# EAGLE design bird (EAGLE 8.3.2)
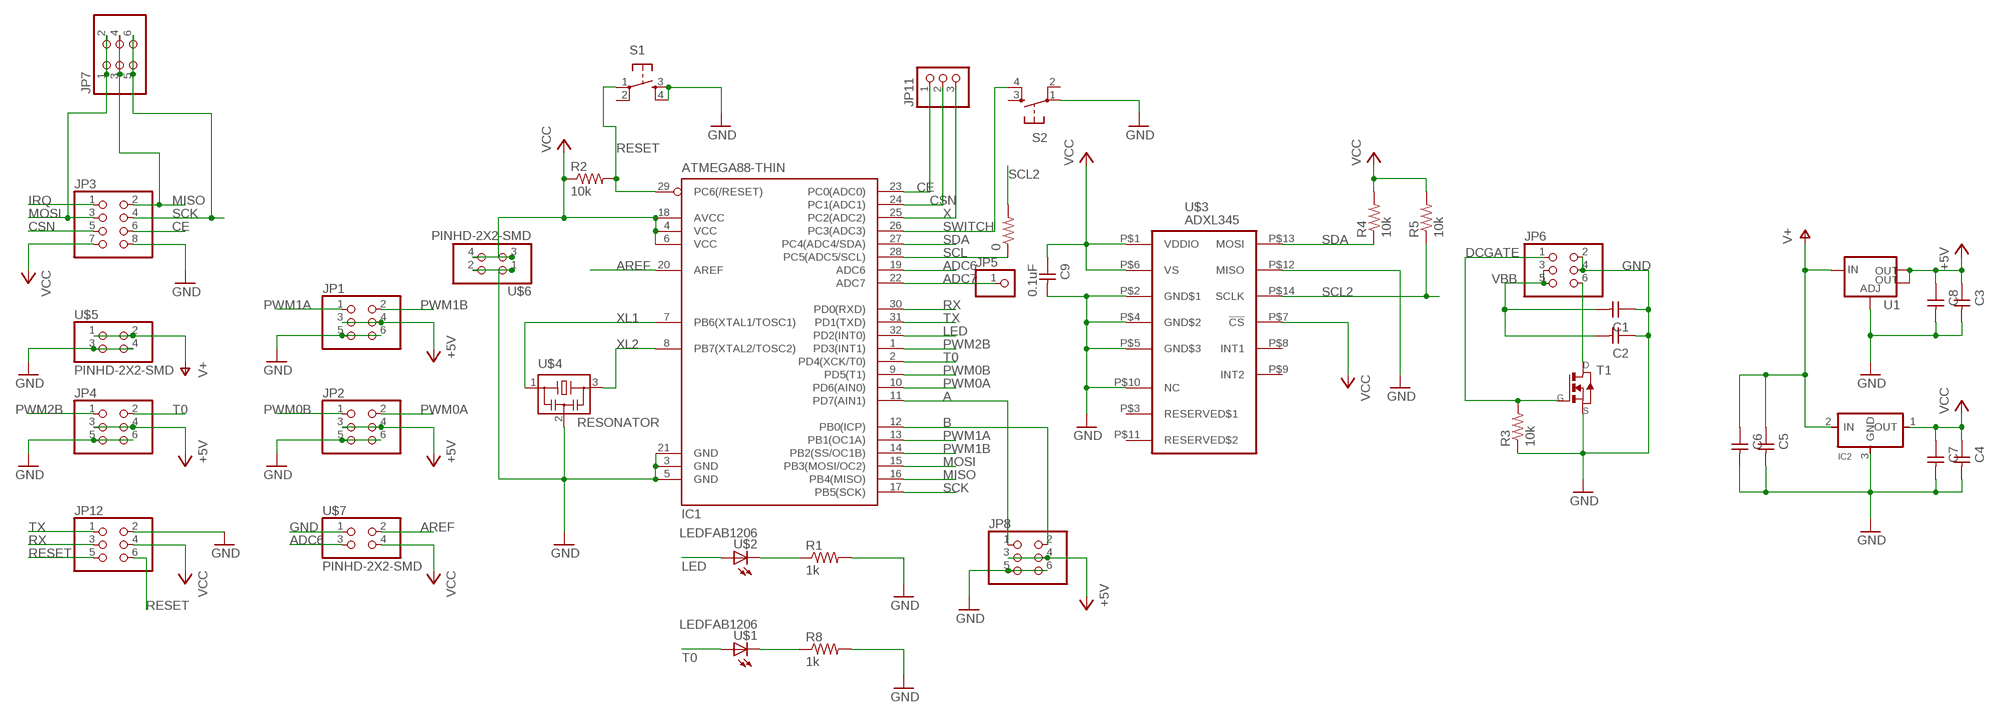
[diagram p0: schematic, sheet 1]

## Parts
0  RES-US1206FAB  [R1206FAB]
C1  CAP-UNPOLARIZEDFAB  [C1206FAB]
C2  CAP-UNPOLARIZEDFAB  [C1206FAB]
C3  CAP-UNPOLARIZEDFAB  [C1206FAB]
C4  CAP-UNPOLARIZEDFAB  [C1206FAB]
C5  CAP-UNPOLARIZEDFAB  [C1206FAB]
C6  CAP-UNPOLARIZEDFAB  [C1206FAB]
C7  CAP-UNPOLARIZEDFAB  [C1206FAB]
C8  CAP-UNPOLARIZEDFAB  [C1206FAB]
C9  0.1uF  CAP-UNPOLARIZEDFAB  [C1206FAB]
IC1  ATMEGA88-THIN  [TQFP32-08THIN]
IC2  REGULATORSOT23  [SOT23]
JP1  PINHD-2X3-SMD  [2X03SMD]
JP2  PINHD-2X3-SMD  [2X03SMD]
JP3  PINHD-2X4SMT  [2X04_SMT]
JP4  PINHD-2X3-SMD  [2X03SMD]
JP5  PINHD-1X1  [1X01]
JP6  PINHD-2X3-SMD  [2X03SMD]
JP7  PINHD-2X3-SMD  [2X03SMD]
JP8  PINHD-2X3-SMD  [2X03SMD]
JP11  PINHD-1X3  [1X03]
JP12  PINHD-2X3-SMD  [2X03SMD]
R1  1k  RES-US1206FAB  [R1206FAB]
R2  10k  RES-US1206FAB  [R1206FAB]
R3  10k  RES-US1206FAB  [R1206FAB]
R4  10k  RES-US1206FAB  [R1206FAB]
R5  10k  RES-US1206FAB  [R1206FAB]
R8  1k  RES-US1206FAB  [R1206FAB]
S1  6MM_SWITCH6MM_SWITCH  [6MM_SWITCH]
S2  6MM_SWITCH6MM_SWITCH  [6MM_SWITCH]
T1  NMOSFETSOT23  [SOT-23]
U1  V_REG_LM1117SOT223  [SOT223]
U$1  LEDFAB1206  [LED1206FAB]
U$2  LEDFAB1206  [LED1206FAB]
U$3  ADXL345  [LGA14]
U$4  RESONATOR  [EFOBM]
U$5  PINHD-2X2-SMD  [2X02SMD]
U$6  PINHD-2X2-SMD  [2X02SMD]
U$7  PINHD-2X2-SMD  [2X02SMD]

## Nets
+5V: C3.1 C8.1 JP1.3 JP1.4 JP2.3 JP2.4 JP4.3 JP4.4 JP8.3 JP8.4 U1.2(OUT) U1.4(OUT)
A: IC1.11(PD7(AIN1)) JP8.1
ADC6: IC1.19(ADC6) U$7.3
ADC7: IC1.22(ADC7) JP5.1
AREF: IC1.20(AREF) U$7.2
B: IC1.12(PB0(ICP)) JP8.2
CE: IC1.23(PC0(ADC0)) JP3.6 JP11.1
CSN: IC1.24(PC1(ADC1)) JP3.5 JP11.2
DCGATE: JP6.1 R3.2 T1.3(G)
GND: C1.1 C2.1 C3.2 C4.2 C5.2 C6.2 C7.2 C8.2 C9.2 IC1.3(GND) IC1.5(GND) IC1.21(GND) IC2.3(GND) JP1.5 JP1.6 JP2.5 JP2.6 JP3.8 JP4.5 JP4.6 JP6.2 JP6.4 JP8.5 JP8.6 JP12.2 R1.2 R3.1 R8.2 S1.3(S) S1.4(S1) S2.1(P) T1.2(S) U1.1(ADJ) U$3.P$2(GND$1) U$3.P$4(GND$2) U$3.P$5(GND$3) U$3.P$10(NC) U$3.P$12(MISO) U$4.2 U$5.3 U$5.4 U$6.1 U$6.2 U$7.1
IRQ: JP3.1
LED: IC1.32(PD2(INT0)) U$2.1(A)
MISO: IC1.16(PB4(MISO)) JP3.2 JP7.3 JP7.4
MOSI: IC1.15(PB3(MOSI/OC2)) JP3.3 JP7.1 JP7.2
N$1: JP6.6 T1.1(D)
N$2: R1.1 U$2.2(C)
N$3: R8.1 U$1.2(C)
PWM0A: IC1.10(PD6(AIN0)) JP2.2
PWM0B: IC1.9(PD5(T1)) JP2.1
PWM1A: IC1.13(PB1(OC1A)) JP1.1
PWM1B: IC1.14(PB2(SS/OC1B)) JP1.2
PWM2B: IC1.1(PD3(INT1)) JP4.1
RESET: IC1.29(PC6(/RESET)) JP12.5 JP12.6 R2.2 S1.1(P)
RX: IC1.30(PD0(RXD)) JP12.3
SCK: IC1.17(PB5(SCK)) JP3.4 JP7.5 JP7.6
SCL: 0.1 IC1.28(PC5(ADC5/SCL))
SCL2: 0.2 R5.1 U$3.P$14(SCLK)
SDA: IC1.27(PC4(ADC4/SDA)) R4.1 U$3.P$13(MOSI)
SWITCH: IC1.26(PC3(ADC3)) S2.4(S1)
T0: IC1.2(PD4(XCK/T0)) JP4.2 U$1.1(A)
TX: IC1.31(PD1(TXD)) JP12.1
V+: C5.1 C6.1 IC2.2(IN) U1.3(IN) U$5.1 U$5.2
VBB: C1.2 C2.2 JP6.3 JP6.5
VCC: C4.1 C7.1 C9.1 IC1.4(VCC) IC1.6(VCC) IC1.18(AVCC) IC2.1(OUT) JP3.7 JP12.4 R2.1 R4.2 R5.2 U$3.P$1(VDDIO) U$3.P$6(VS) U$3.P$7(!CS) U$6.3 U$6.4 U$7.4
X: IC1.25(PC2(ADC2)) JP11.3
XL1: IC1.7(PB6(XTAL1/TOSC1)) U$4.1
XL2: IC1.8(PB7(XTAL2/TOSC2)) U$4.3
Unconnected: S1.2(P1) S2.2(P1) S2.3(S) U$3.P$3(RESERVED$1) U$3.P$8(INT1) U$3.P$9(INT2) U$3.P$11(RESERVED$2)

## Library data of the parts
0 R1-R5 R8 = fab:RES-US: Resistor (US Symbol) Variants with postfix FAB are widened to allow the routing of internal traces
C1-C9 = fab:CAP-UNPOLARIZED
IC1 = fab:ATMEGA88-THIN
IC2 = fab:REGULATOR
JP1 JP2 JP4 JP6-JP8 JP12 = fab:PINHD-2X3-SMD: PIN HEADER
JP3 = pinhead+:PINHD-2X4: PIN HEADER
JP5 = pinhead:PINHD-1X1: PIN HEADER
JP11 = pinhead+:PINHD-1X3: PIN HEADER
S1 S2 = fab:6MM_SWITCH: OMRON SWITCH
T1 = fab:NMOSFET: MOS FET
U1 = fab:V_REG_LM1117: Voltage Regulator LM1117 Standard adjustable voltage regulator but in SMD form. Spark Fun Electronics SKU : COM-00595; PROD_ID: VREG-08170
U$1 U$2 = fab:LED: LED
U$3 = adxl345_small:ADXL345: 3-Axis, ±2 g/±4 g/±8 g/±16 g Digital Accelerometer
U$4 = fab:RESONATOR
U$5-U$7 = fab:PINHD-2X2-SMD

## Board
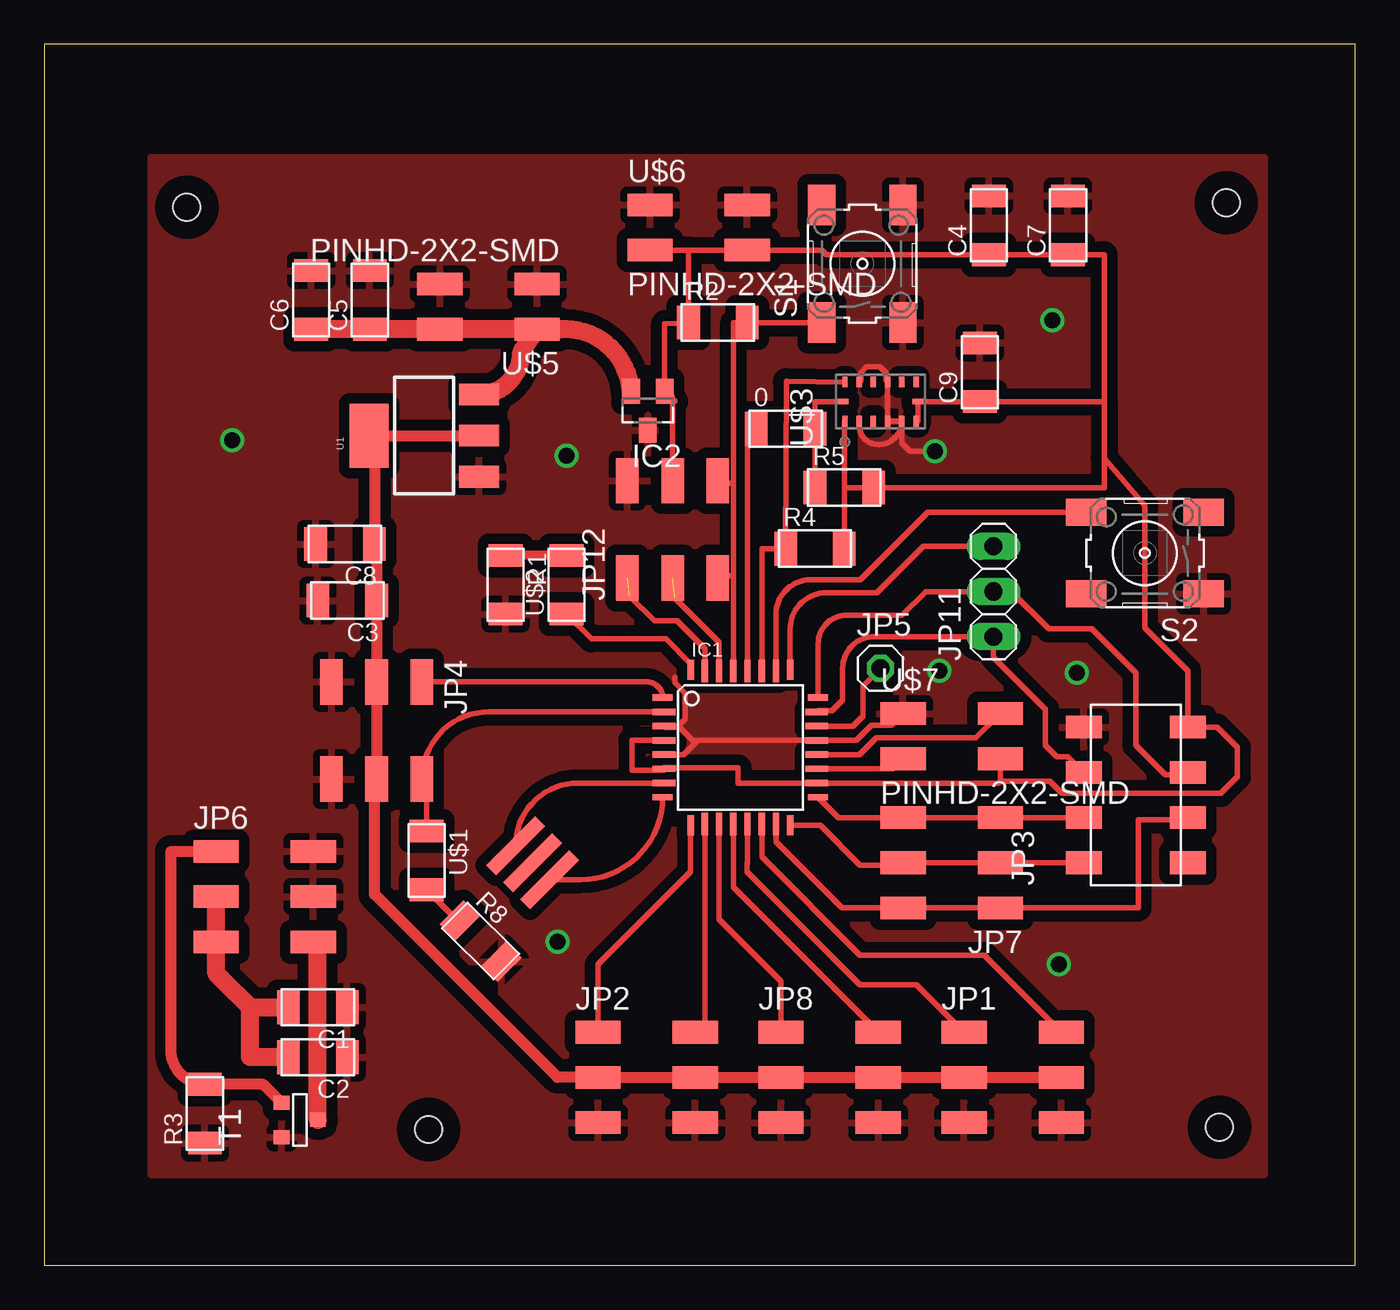
[diagram p1: board, top side]
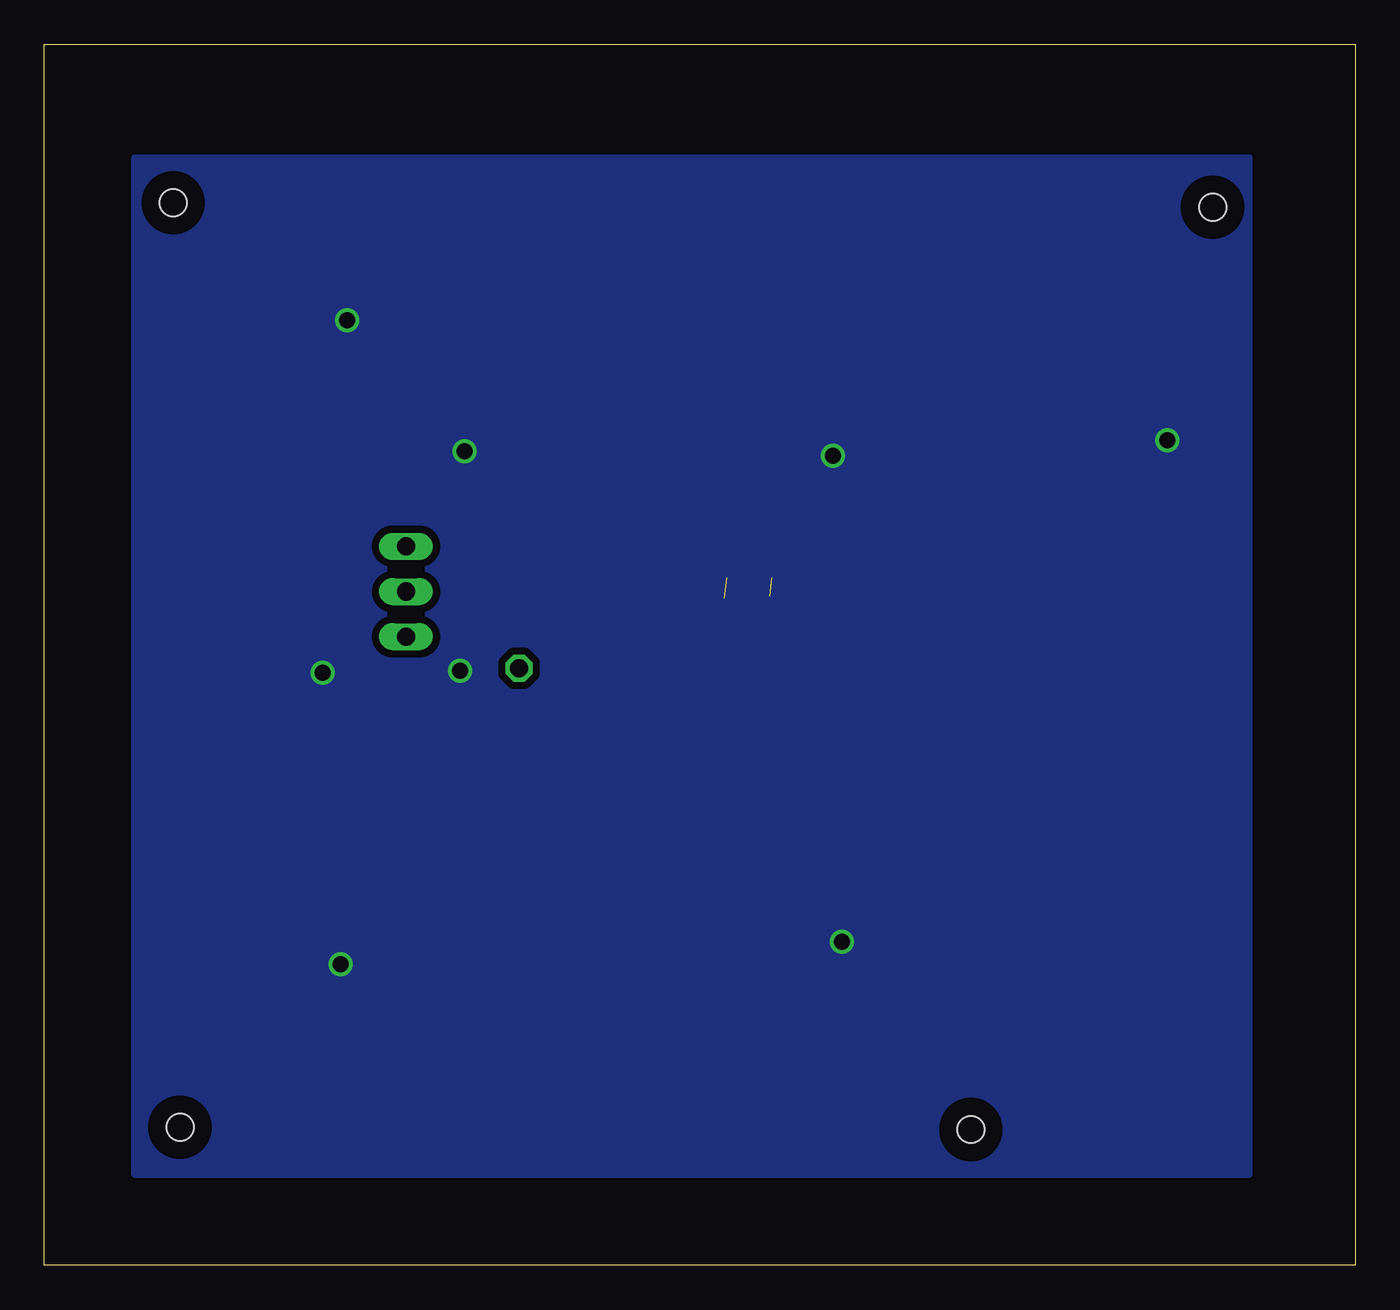
[diagram p2: board, bottom side, seen from below]

Size 73.66 x 68.58 mm. Coordinates in mm from the lower left corner, seen from the top.
Outline: 0,0 73.66,0 73.66,68.58 0,68.58 0,0
Copper layers (1*16): Top 0.035mm / dielectric 1.5mm / Bottom 0.035mm
Design rules "fab *": minimum track width 0.3mm, minimum drill 32mil, track to track 0.397mm, track to pad 0.397mm, pad to pad 0.397mm, via to via 0.397mm, smd to smd 0.397mm, copper to edge 40mil, drill to drill 16mil, minimum pad ring 10mil, minimum via ring 8mil, stop-mask expansion 4mil, vias tented up to drill 0mil, thermal gap 16mil
Holes 1.52 mm at 8,59.44 21.59,7.62 66.04,7.75 66.42,59.69

### Footprints (pad centres in the part's own frame; a part is rotated, then mirrored left to right if it is on the bottom)
R1206FAB = smd 1.27 x 1.905: 1 -1.651,0; 2 1.651,0
C1206FAB = smd 1.27 x 1.905: 1 -1.651,0; 2 1.651,0
TQFP32-08THIN = smd 1.118 x 0.356: 1 -4.369,2.8; 8 -4.369,-2.8; 17 4.369,-2.8; 24 4.369,2.8 | smd 1.27 x 0.356: 2 -4.293,2; 3 -4.293,1.2; 4 -4.293,0.4; 5 -4.293,-0.4; 6 -4.293,-1.2; 7 -4.293,-2; 18 4.293,-2; 19 4.293,-1.2; 20 4.293,-0.4; 21 4.293,0.4; 22 4.293,1.2; 23 4.293,2 | smd 0.356 x 1.118: 9 -2.8,-4.369; 16 2.8,-4.369; 25 2.8,4.369; 32 -2.8,4.369 | smd 0.356 x 1.27: 10 -2,-4.293; 14 1.2,-4.293; 15 2,-4.293; 26 2,4.293; 27 1.2,4.293; 31 -2,4.293 | smd 0.35 x 1.27: 11 -1.2,-4.293; 12 -0.4,-4.293; 13 0.4,-4.293; 28 0.4,4.293; 29 -0.4,4.293; 30 -1.2,4.293
SOT23 = smd 1 x 1.4: 1 -0.95,-1.1; 2 0.95,-1.1; 3 0,1.1
2X03SMD = smd 2.54 x 1.27: 1 -2.54,2.54; 2 2.92,2.54; 3 -2.54,0; 4 2.92,0; 5 -2.54,-2.54; 6 2.92,-2.54
2X04_SMT = smd 1.27 x 2.032: 1 -3.81,-2.921; 2 -3.81,2.921; 3 -1.27,-2.921; 4 -1.27,2.921; 5 1.27,-2.921; 6 1.27,2.921; 7 3.81,-2.921; 8 3.81,2.921
1X01 = drill 1.016 octagon: 1 0,0
1X03 = drill 1.016 long: 1 -2.54,0; 2 0,0; 3 2.54,0
6MM_SWITCH = smd 2.286 x 1.524: 1 -3.302,2.286; 2 3.302,2.286; 3 -3.302,-2.286; 4 3.302,-2.286
SOT-23 = smd 0.787 x 0.889: 1 0.025,-1.016; 2 -0.94,1.016; 3 0.991,1.016
SOT223 = smd 1.219 x 2.235: 1 -2.311,-3.099; 2 0,-3.099; 3 2.311,-3.099 | smd 3.6 x 2.2: 4 0,3.099
LED1206FAB = smd 1.27 x 1.905: 1 -1.651,0; 2 1.651,0
LGA14 = smd 0.61 x 0.305: P$1 -1.1,2; P$2 -1.1,1.2; P$3 -1.1,0.4; P$4 -1.1,-0.4; P$5 -1.1,-1.2; P$6 -1.1,-2; P$8 1.1,-2; P$9 1.1,-1.2; P$10 1.1,-0.4; P$11 1.1,0.4; P$12 1.1,1.2; P$13 1.1,2 | smd 0.305 x 0.61: P$7 0,-2.1; P$14 0,2.1
EFOBM = smd 0.8 x 3.9: 1 -1.35,0; 2 0,0; 3 1.35,0
2X02SMD = smd 2.54 x 1.27: 1 -2.54,1.27; 2 2.92,1.27; 3 -2.54,-1.27; 4 2.92,-1.27

### Placement (x,y rotation side)
0  41.66,46.99 0 top
C1  15.37,14.48 180 top
C2  15.37,11.68 180 top
C3  17.02,37.34 180 top
C4  53.09,58.42 90 top
C5  18.29,54.23 90 top
C6  14.99,54.23 90 top
C7  57.53,58.42 90 top
C8  16.89,40.51 180 top
C9  52.58,50.16 90 top
IC1  39.12,29.08 0 top
IC2  33.91,48.01 180 top
JP1  54.23,10.54 0 top
JP2  33.66,10.54 0 top
JP3  61.34,26.42 90 top
JP4  18.67,30.23 270 top
JP5  46.99,33.53 0 top
JP6  12.19,20.7 0 top
JP7  51.18,22.61 180 top
JP8  43.94,10.54 0 top
JP11  53.34,37.85 90 top
JP12  35.31,41.15 90 top
R1  25.91,38.23 270 top
R2  37.85,52.96 0 top
R3  9.02,8.51 90 top
R4  43.31,40.26 0 top
R5  44.96,43.69 0 top
R8  24.51,18.21 315 top
S1  45.97,56.26 90 top
S2  61.85,40.01 180 top
T1  14.35,8.13 90 top
U1  21.34,46.61 90 top
U$1  21.48,22.74 270 top
U$2  29.34,38.23 90 top
U$3  46.99,48.51 90 top
U$4  27.43,22.61 315 top
U$5  25.15,53.85 180 top
U$6  36.58,58.29 0 top
U$7  50.8,29.72 0 top

### Tracks (layer width: path | path; a pad name or v marks a point on that pad's centre or on a via)
+5V
  Top 0.3: 18.67,46.18 U1.4 18.54,46.61 | JP4.4 18.81,27.11 18.54,26.84 | C8.1 18.67,40.51
  Top 0.61: JP4.4 JP4.3 C3.1 18.67,40.51 | U1.4 U1.2 | 18.54,26.84 18.54,20.83 28.83,10.54 JP2.3 JP2.4 JP8.3 JP8.4 JP1.3 | 18.54,46.61 C8.1 | JP1.3 52.2,10.54 JP1.3 | JP1.3 JP1.4
A
  Top 0.3: IC1.11 37.92,19.43 41.4,15.95 JP8.1
ADC6
  Top 0.3: IC1.19 47.7,27.88 U$7.3
ADC7
  Top 0.3: IC1.22 45.45,30.28 46,30.84 46,32.54 JP5.1
AREF
  Top 0.3: U$7.2 52.36,29.63 46.76,29.63 45.82,28.68 IC1.20
B
  Top 0.3: IC1.12 38.72,21.23 JP8.2
CE
  Top 0.3: IC1.23 43.48,31.16 44.27,31.16 44.86,31.75 44.86,33.53 arc-90 46.64,35.31 JP11.1 53.34,34.16 56.26,31.24 56.26,29.21 56.9,28.57 57.53,28.57 JP3.6
CSN
  Top 0.3: JP3.5 64.14,27.56 62.99,27.56 61.34,29.21 61.34,33.27 58.86,35.75 56.45,35.75 54.36,37.85 JP11.2 49.53,37.85 48.2,36.51 45.09,36.51 arc90 43.48,34.91 IC1.24
DCGATE
  Top 0.61: JP6.1 7.11,23.24 7.11,12.06 arc90 R3.2 12.29,10.16 T1.3
GND  (via drill 0.9)
  Top 0.3: IC1.5 35.92,28.68 36.7,29.46 36.43,29.46 36.41,29.48 | U$3.P$5 48.19,46.17 48.64,45.72 v50.04,45.72 | U$3.P$2 45.79,47.17 arc90 46.86,46.1 46.88,46.1 arc90 U$3.P$5 | U$3.P$5 U$3.P$4 U$3.P$10 47.29,49.72 47.29,50.15 46.97,50.47 46.21,50.47 45.89,50.15 45.89,49.72 U$3.P$12 | 36.41,29.48 IC1.21 45.63,29.48 46.48,30.33 47.6,30.33 U$7.1 | 36.41,29.48 35.69,30.21 34.9,30.21 IC1.3 35.61,30.28 36.01,30.68 36.01,32.13 35.43,32.71 35.43,33.02
  other vias: 29.34,45.47 10.54,46.35 28.83,18.16 57.02,16.89 50.29,33.4 58.04,33.27 56.64,53.09
  pour Bottom (isolate 0.406): 68.58,62.23 5.97,62.23 5.97,5.08 68.58,5.08
  pour Top (isolate 0.61): 68.58,62.23 5.97,62.23 5.97,5.08 68.58,5.08
LED
  Top 0.3: IC1.32 36.32,33.79 34.92,35.18 30.73,35.18 U$2.1
MISO
  Top 0.3: IC1.16 43.61,24.71 45.85,22.48 48.13,22.48 JP7.4 JP7.3 JP3.2
MOSI
  Top 0.3: IC1.15 41.12,23.78 44.83,20.07 JP7.2 JP7.1 61.47,20.07 61.47,25.02 64.26,25.02 JP3.3
N$1
  Top 0.3: 15.37,17.91 JP6.6
  Top 1.016: T1.1 15.37,17.91
N$2
  Top 0.508: U$2.2 R1.1
N$3
  Top 0.3: R8.1 23.19,19.38 U$1.2
PWM0A
  Top 0.3: IC1.10 37.12,13.62 JP2.2
PWM0B
  Top 0.3: IC1.9 36.32,22.09 31.11,16.89 JP2.1
PWM1A
  Top 0.3: IC1.13 39.52,22.59 39.5,22.57 39.5,22.1 45.85,15.75 49.02,15.75 JP1.1
PWM1B
  Top 0.3: JP1.2 52.83,17.4 45.85,17.4 40.32,22.93 IC1.14
PWM2B
  Top 0.3: IC1.1 arc90 33.86,32.77 JP4.1
RESET
  Top 0.3: IC1.29 38.73,33.38 38.73,38.73 | 38.73,38.73 38.73,43.94 | 38.73,43.94 38.73,52.96 R2.2 S1.1 | 38.73,38.73 37.97,38.73 arc90 JP12.5 | 38.73,43.94 37.97,43.94 arc-90 JP12.6
RX  (1 unrouted)
  Top 0.3: IC1.30 37.92,34.98 35.43,37.47
SCK
  Top 0.3: JP3.4 JP7.5 JP7.6 44.62,25.15 IC1.17
SCL
  Top 0.3: 0.1 39.52,46.99 IC1.28
SCL2
  Top 0.3: R5.1 0.2 43.31,48.51 U$3.P$14
SDA
  Top 0.3: U$3.P$13 41.7,49.66 R4.1 40.32,40.26 IC1.27
SWITCH
  Top 0.3: S2.4 49.66,42.29 45.87,38.5 43.05,38.5 arc90 41.12,36.56 IC1.26
T0
  Top 0.3: IC1.2 24.99,31.08 arc90 JP4.2 21.48,27.04 U$1.1
TX  (1 unrouted)
  Top 0.3: 32.89,37.59 34.29,36.2 35.56,36.2 37.12,34.64 IC1.31
V+
  Top 1.016: U$5.1 U$5.2 C5.1 C6.1 | U1.3 arc90 26.8,51.28 U$5.1 | IC2.2 arc90 28.98,52.58 U$5.1
VBB
  Top 1.016: JP6.3 JP6.5 9.65,16.38 9.97,16.07 | 11.56,14.48 C1.2 | 9.97,16.07 11.56,14.48 | 11.56,14.48 9.97,16.07 | C2.2 11.56,11.68 11.56,14.48
VCC
  Top 0.3: 34.93,49.03 35.43,48.53 | 34.93,49.03 IC2.1 34.86,52.9 R2.1 36.2,57.02 | IC1.4 33.02,29.48 33.02,27.81 34.82,27.81 IC1.6 34.82,27.94 38.99,27.94 38.99,27.08 IC1.18 53.63,27.08 53.72,27.18 | U$3.P$1 44.96,47.41 44.96,43.69 | 44.96,43.69 R4.2 | 44.96,43.69 R5.2 59.56,43.69 59.56,45.34 | U$3.P$6 49.09,47.41 U$3.P$7 C9.1 59.56,48.51 | 59.56,48.51 59.56,56.77 C7.1 C4.1 43.94,56.77 43.69,57.02 U$6.4 36.2,57.02 | 59.56,48.51 59.56,45.34 | 59.56,45.34 61.85,42.67 61.85,35.81 64.26,33.4 JP3.7 65.91,30.23 67.06,29.08 67.06,27.43 66.13,26.5 57.18,26.5 56.5,27.18 53.72,27.18 | JP12.4 35.31,48.66 arc90 34.93,49.03 | 36.2,57.02 U$6.3 | 53.72,27.18 U$7.4
X
  Top 0.3: IC1.25 41.91,35.74 arc-90 43.94,37.77 46.79,37.77 49.4,40.39 JP11.3
XL1
  Top 0.3: IC1.7 30,27.08 arc90 U$4.1
XL2
  Top 0.3: U$4.3 30.12,21.65 arc90 IC1.8